# EAGLE design mimic4218 (EAGLE 7.5.0)
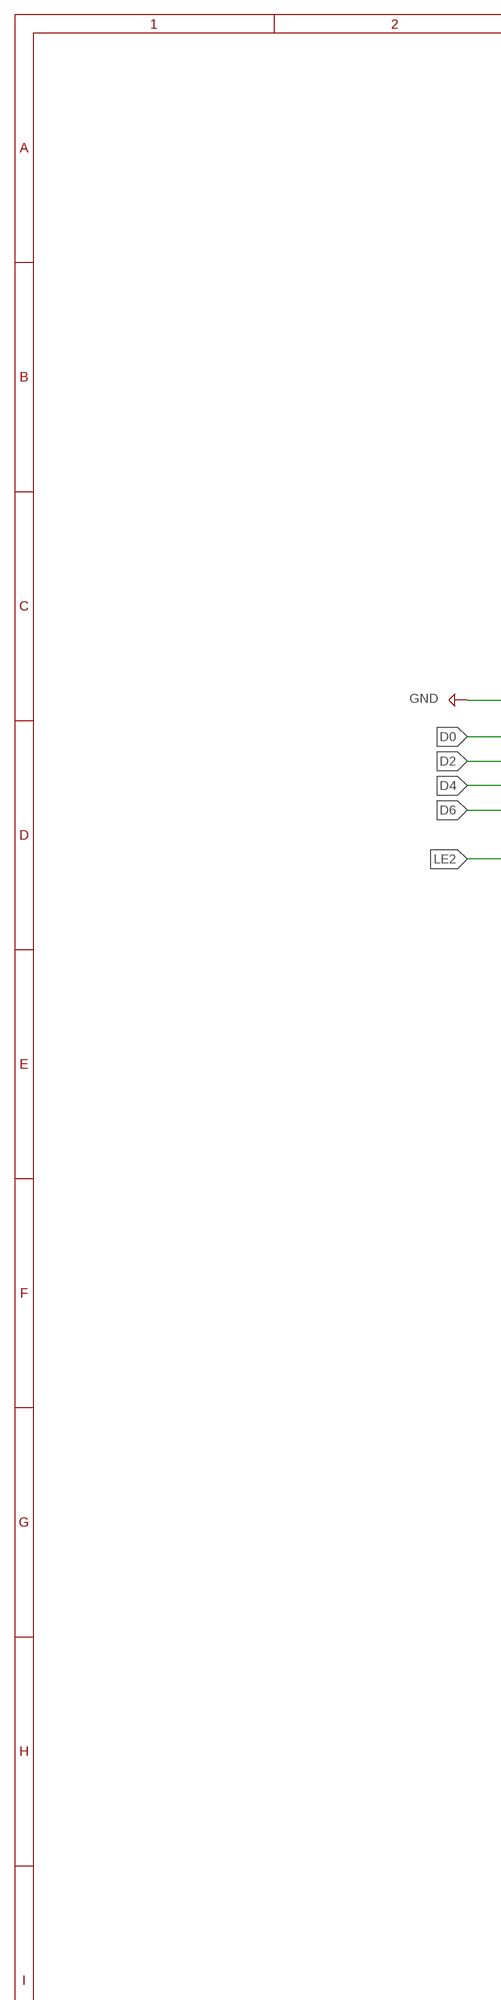
[diagram p0: schematic, sheet 1, part 1 of 2]
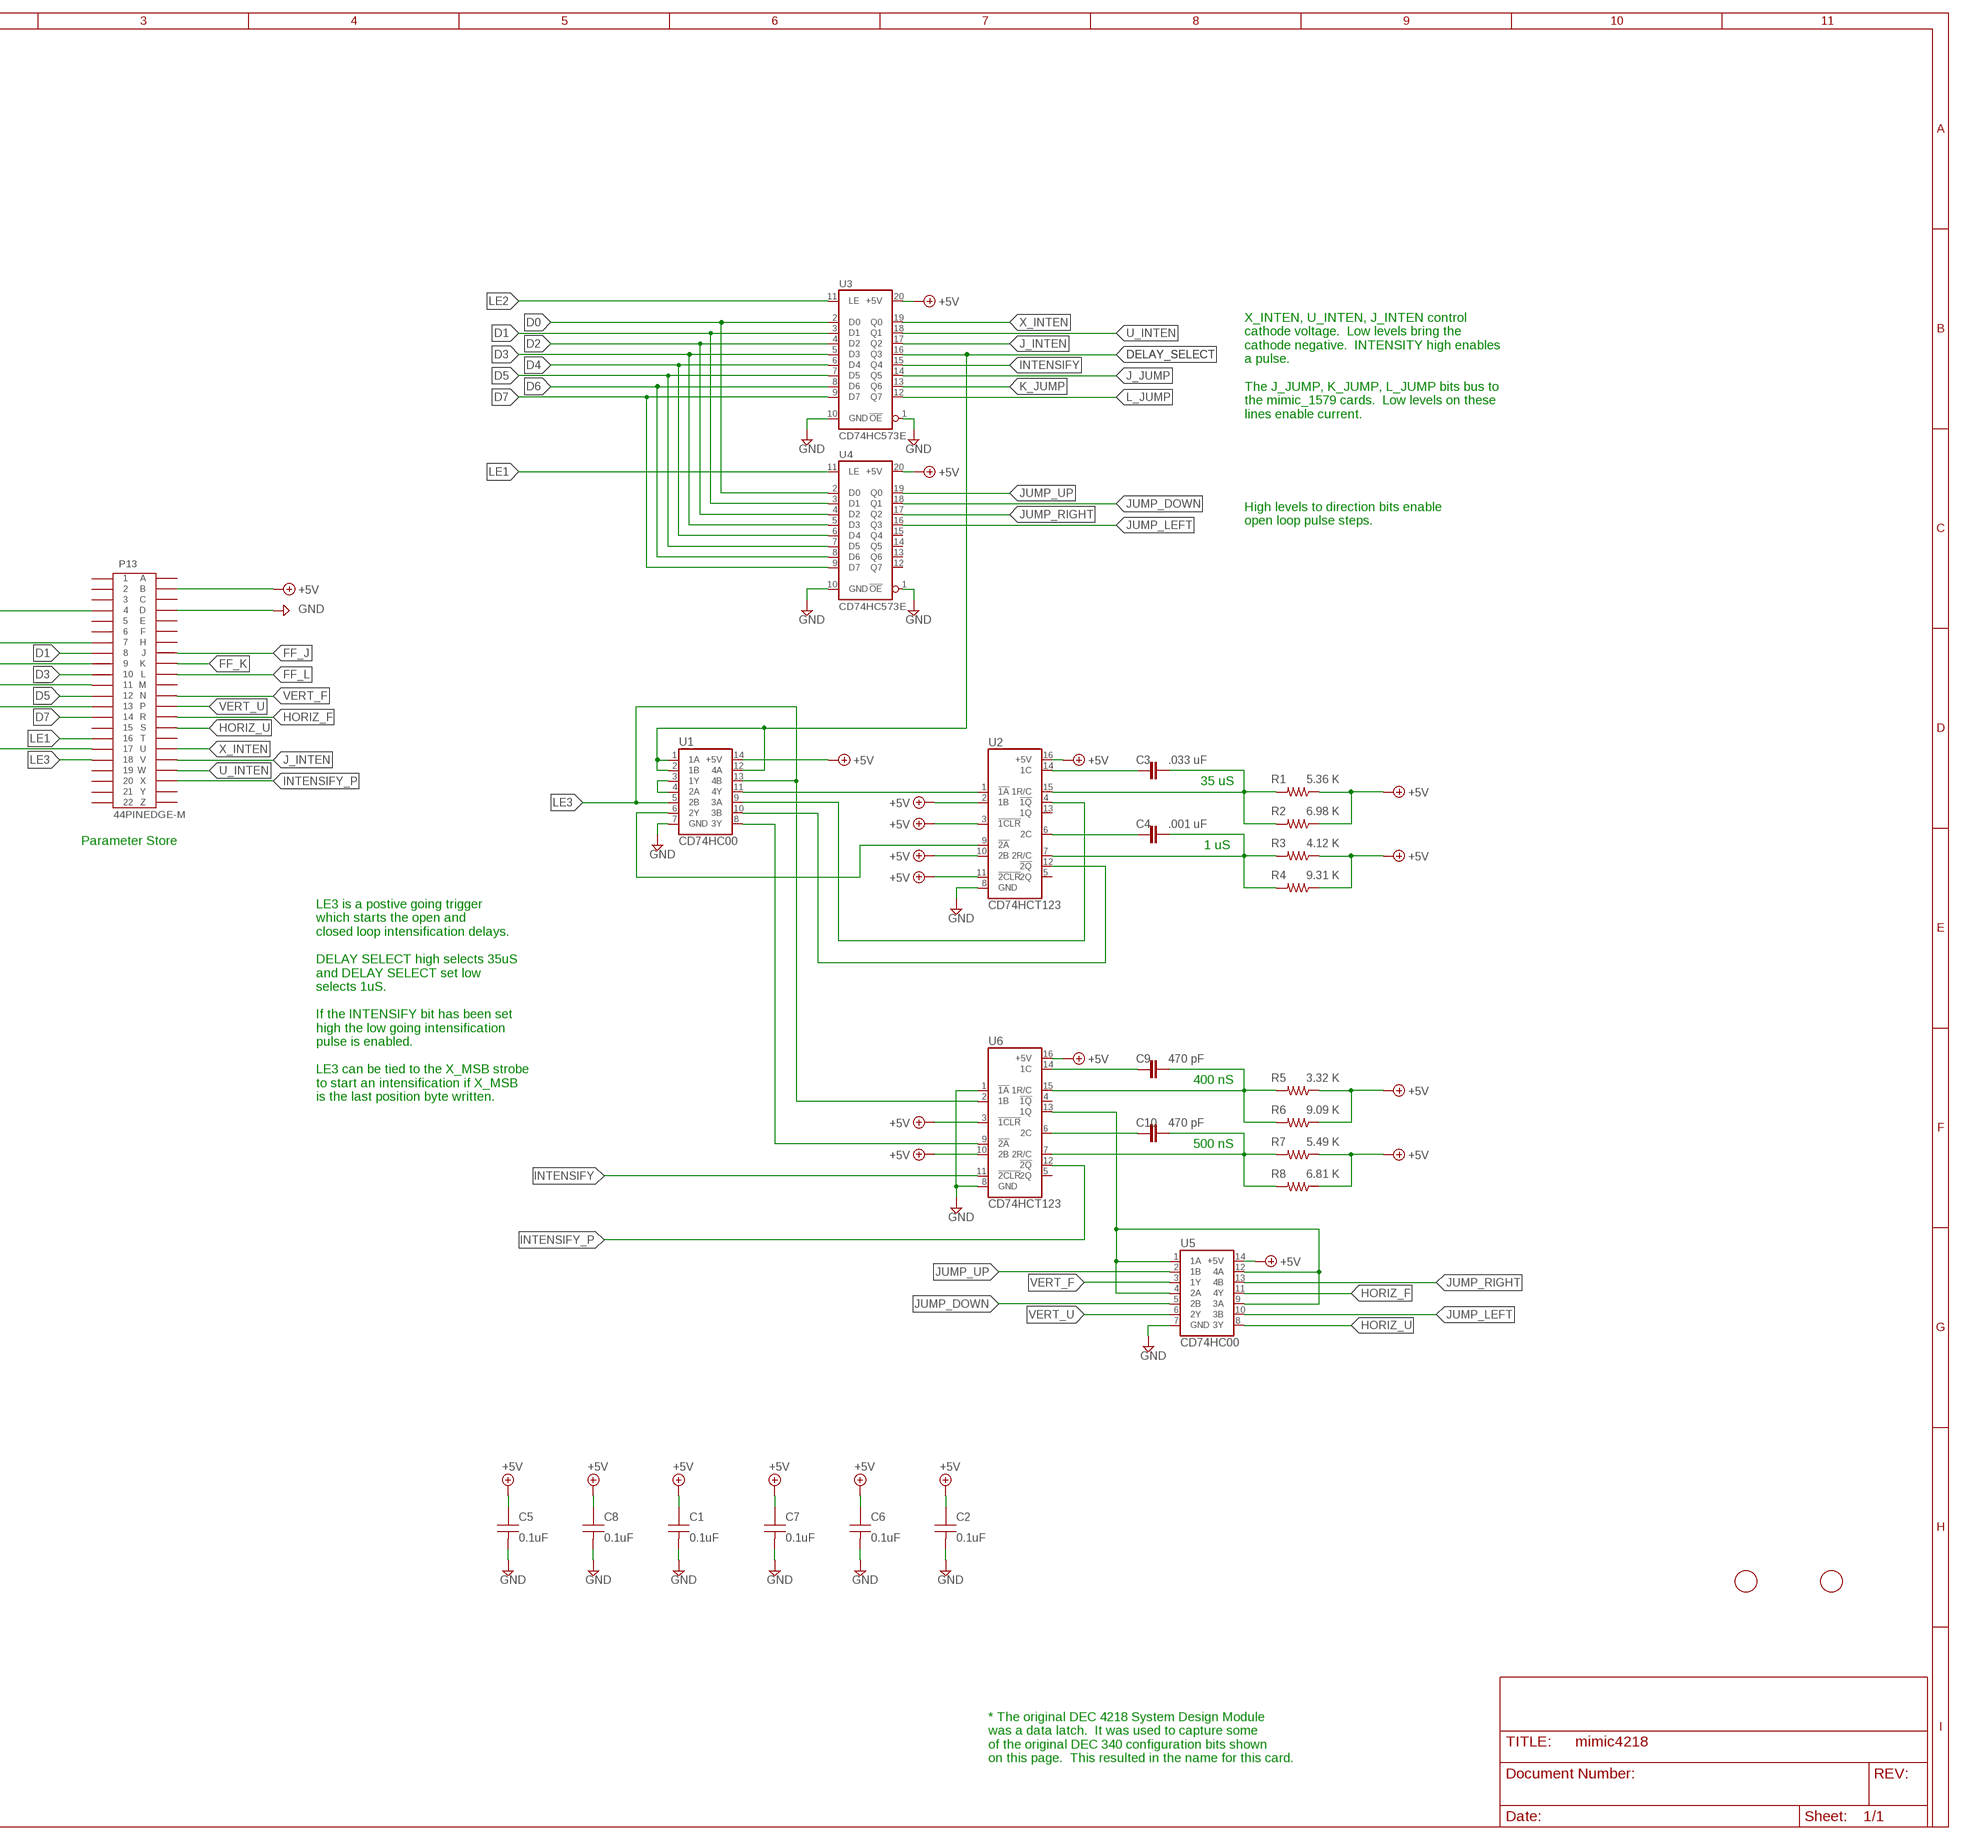
[diagram p1: schematic, sheet 1, part 2 of 2]

## Parts
C1  0.1uF  CAP0.1UF100V  [5MM_TH]
C2  0.1uF  CAP0.1UF100V  [5MM_TH]
C3  .033 uF  CAP_5MM  [5MM_TH]
C4  .001 uF  CAP_5MM  [5MM_TH]
C5  0.1uF  CAP0.1UF100V  [5MM_TH]
C6  0.1uF  CAP0.1UF100V  [5MM_TH]
C7  0.1uF  CAP0.1UF100V  [5MM_TH]
C8  0.1uF  CAP0.1UF100V  [5MM_TH]
C9  470 pF  CAP_5MM  [5MM_TH]
C10  470 pF  CAP_5MM  [5MM_TH]
P13  44PINEDGE-M  [44PINEDGE]
R1  5.36 K  R-1/4WATT  [0207/10]
R2  6.98 K  R-1/4WATT  [0207/10]
R3  4.12 K  R-1/4WATT  [0207/10]
R4  9.31 K  R-1/4WATT  [0207/10]
R5  3.32 K  R-1/4WATT  [0207/10]
R6  9.09 K  R-1/4WATT  [0207/10]
R7  5.49 K  R-1/4WATT  [0207/10]
R8  6.81 K  R-1/4WATT  [0207/10]
U1  CD74HC00  [DIP-14]
U2  CD74HCT123  [DIP-16]
U3  CD74HC573E  [DIP-20]
U4  CD74HC573E  [DIP-20]
U5  CD74HC00  [DIP-14]
U6  CD74HCT123  [DIP-16]
U$1  FIDUCIAL  [FIDUCIAL_1MM]
U$2  FIDUCIAL  [FIDUCIAL_1MM]

## Nets
+5V: C1.1 C2.1 C5.1 C6.1 C7.1 C8.1 P13.B R1.1 R2.1 R3.1 R4.1 R5.1 R6.1 R7.1 R8.1 U1.14(+5V) U2.2(1B) U2.3(!1CLR) U2.10(2B) U2.11(!2CLR) U2.16(+5V) U3.20(+5V) U4.20(+5V) U5.14(+5V) U6.3(!1CLR) U6.10(2B) U6.16(+5V)
D0: P13.7 U3.2(D0) U4.2(D0)
D1: P13.8 U3.3(D1) U4.3(D1)
D2: P13.9 U3.4(D2) U4.4(D2)
D3: P13.10 U3.5(D3) U4.5(D3)
D4: P13.11 U3.6(D4) U4.6(D4)
D5: P13.12 U3.7(D5) U4.7(D5)
D6: P13.13 U3.8(D6) U4.8(D6)
D7: P13.14 U3.9(D7) U4.9(D7)
DELAY_SELECT: U1.1(1A) U1.2(1B) U1.12(4A) U3.16(Q3)
FF_J: P13.J
FF_K: P13.K
FF_L: P13.L
GND: C1.2 C2.2 C5.2 C6.2 C7.2 C8.2 P13.4 P13.D U1.7(GND) U2.8(GND) U3.1(!OE) U3.10(GND) U4.1(!OE) U4.10(GND) U5.7(GND) U6.1(!1A) U6.8(GND)
HORIZ_F: P13.R U5.11(4Y)
HORIZ_U: P13.S U5.8(3Y)
INTENSIFY: U3.15(Q4) U6.11(!2CLR)
INTENSIFY_P: P13.X U6.12(!2Q)
J_INTEN: P13.V U3.17(Q2)
J_JUMP: U3.14(Q5)
JUMP_DOWN: U4.18(Q1) U5.5(2B)
JUMP_LEFT: U4.16(Q3) U5.10(3B)
JUMP_RIGHT: U4.17(Q2) U5.13(4B)
JUMP_UP: U4.19(Q0) U5.2(1B)
K_JUMP: U3.13(Q6)
L_JUMP: U3.12(Q7)
LE1: P13.16 U4.11(LE)
LE2: P13.17 U3.11(LE)
LE3: P13.18 U1.5(2B) U1.13(4B) U6.2(1B)
N$1: C3.1 U2.14(1C)
N$2: C3.2 R1.2 R2.2 U2.15(1R/C)
N$3: C4.1 U2.6(2C)
N$4: C4.2 R3.2 R4.2 U2.7(2R/C)
N$5: C9.1 U6.14(1C)
N$6: C10.2 R7.2 R8.2 U6.7(2R/C)
N$7: C10.1 U6.6(2C)
N$8: C9.2 R5.2 R6.2 U6.15(1R/C)
N$9: U1.11(4Y) U2.1(!1A)
N$10: U1.3(1Y) U1.4(2A)
N$11: U5.1(1A) U5.4(2A) U5.9(3A) U5.12(4A) U6.13(1Q)
N$12: U1.6(2Y) U2.9(!2A)
N$13: U1.9(3A) U2.4(!1Q)
N$14: U1.10(3B) U2.12(!2Q)
N$15: U1.8(3Y) U6.9(!2A)
U_INTEN: P13.W U3.18(Q1)
VERT_F: P13.N U5.3(1Y)
VERT_U: P13.P U5.6(2Y)
X_INTEN: P13.U U3.19(Q0)
Unconnected: P13.1 P13.2 P13.3 P13.5 P13.6 P13.15 P13.19 P13.20 P13.21 P13.22 P13.A P13.C P13.E P13.F P13.H P13.M P13.T P13.Y P13.Z U2.5(2Q) U2.13(1Q) U4.12(Q7) U4.13(Q6) U4.14(Q5) U4.15(Q4) U6.4(!1Q) U6.5(2Q)

## Notes on the sheet
- X_INTEN, U_INTEN, J_INTEN control 
  cathode voltage.  Low levels bring the 
  cathode negative.  INTENSITY high enables 
  a pulse.
  
  The J_JUMP, K_JUMP, L_JUMP bits bus to 
  the mimic_1579 cards.  Low levels on these 
  lines enable current.
- High levels to direction bits enable 
  open loop pulse steps.
- 35 uS
- Parameter Store
- 1 uS
- 400 nS
- LE3 is a postive going trigger 
  which starts the open and 
  closed loop intensification delays.
  
  DELAY SELECT high selects 35uS 
  and DELAY SELECT set low 
  selects 1uS.
  
  If the INTENSIFY bit has been set 
  high the low going intensification
  pulse is enabled.
  
  LE3 can be tied to the X_MSB strobe 
  to start an intensification if X_MSB 
  is the last position byte written.
- 500 nS
- * The original DEC 4218 System Design Module 
  was a data latch.  It was used to capture some 
  of the original DEC 340 configuration bits shown 
  on this page.  This resulted in the name for this card.

## Library data of the parts
C1 C2 C5-C8 = keiths:CAP0.1UF100V: 0.1µF ±10% 100V Ceramic X8R TH; MPN: FA26X8R2A104KNU06
C3 C4 C9 C10 = keiths:CAP_5MM: Through hole radial, 5m pin spacing.
P13 = keiths:44PINEDGE-M: 44 PIN EDGE CONNECTOR FOR PCB
R1-R8 = keiths:R-1/4WATT: Quarter watt through hole resistor.
U1 U5 = keiths:CD74HC00: Quad 2-Input NAND Gate
U2 U6 = keiths:CD74HCT123: High-Speed CMOS Logic Dual Retriggerable Monostable Multivibrator
U3 U4 = keiths:CD74HC573E: Octal Transparent D-Type Latches With 3-State Outputs
U$1 U$2 = adafruit:FIDUCIAL: For use by pick and place machines to calibrate the vision/machine, 1mm By microbuilder.eu

## Board
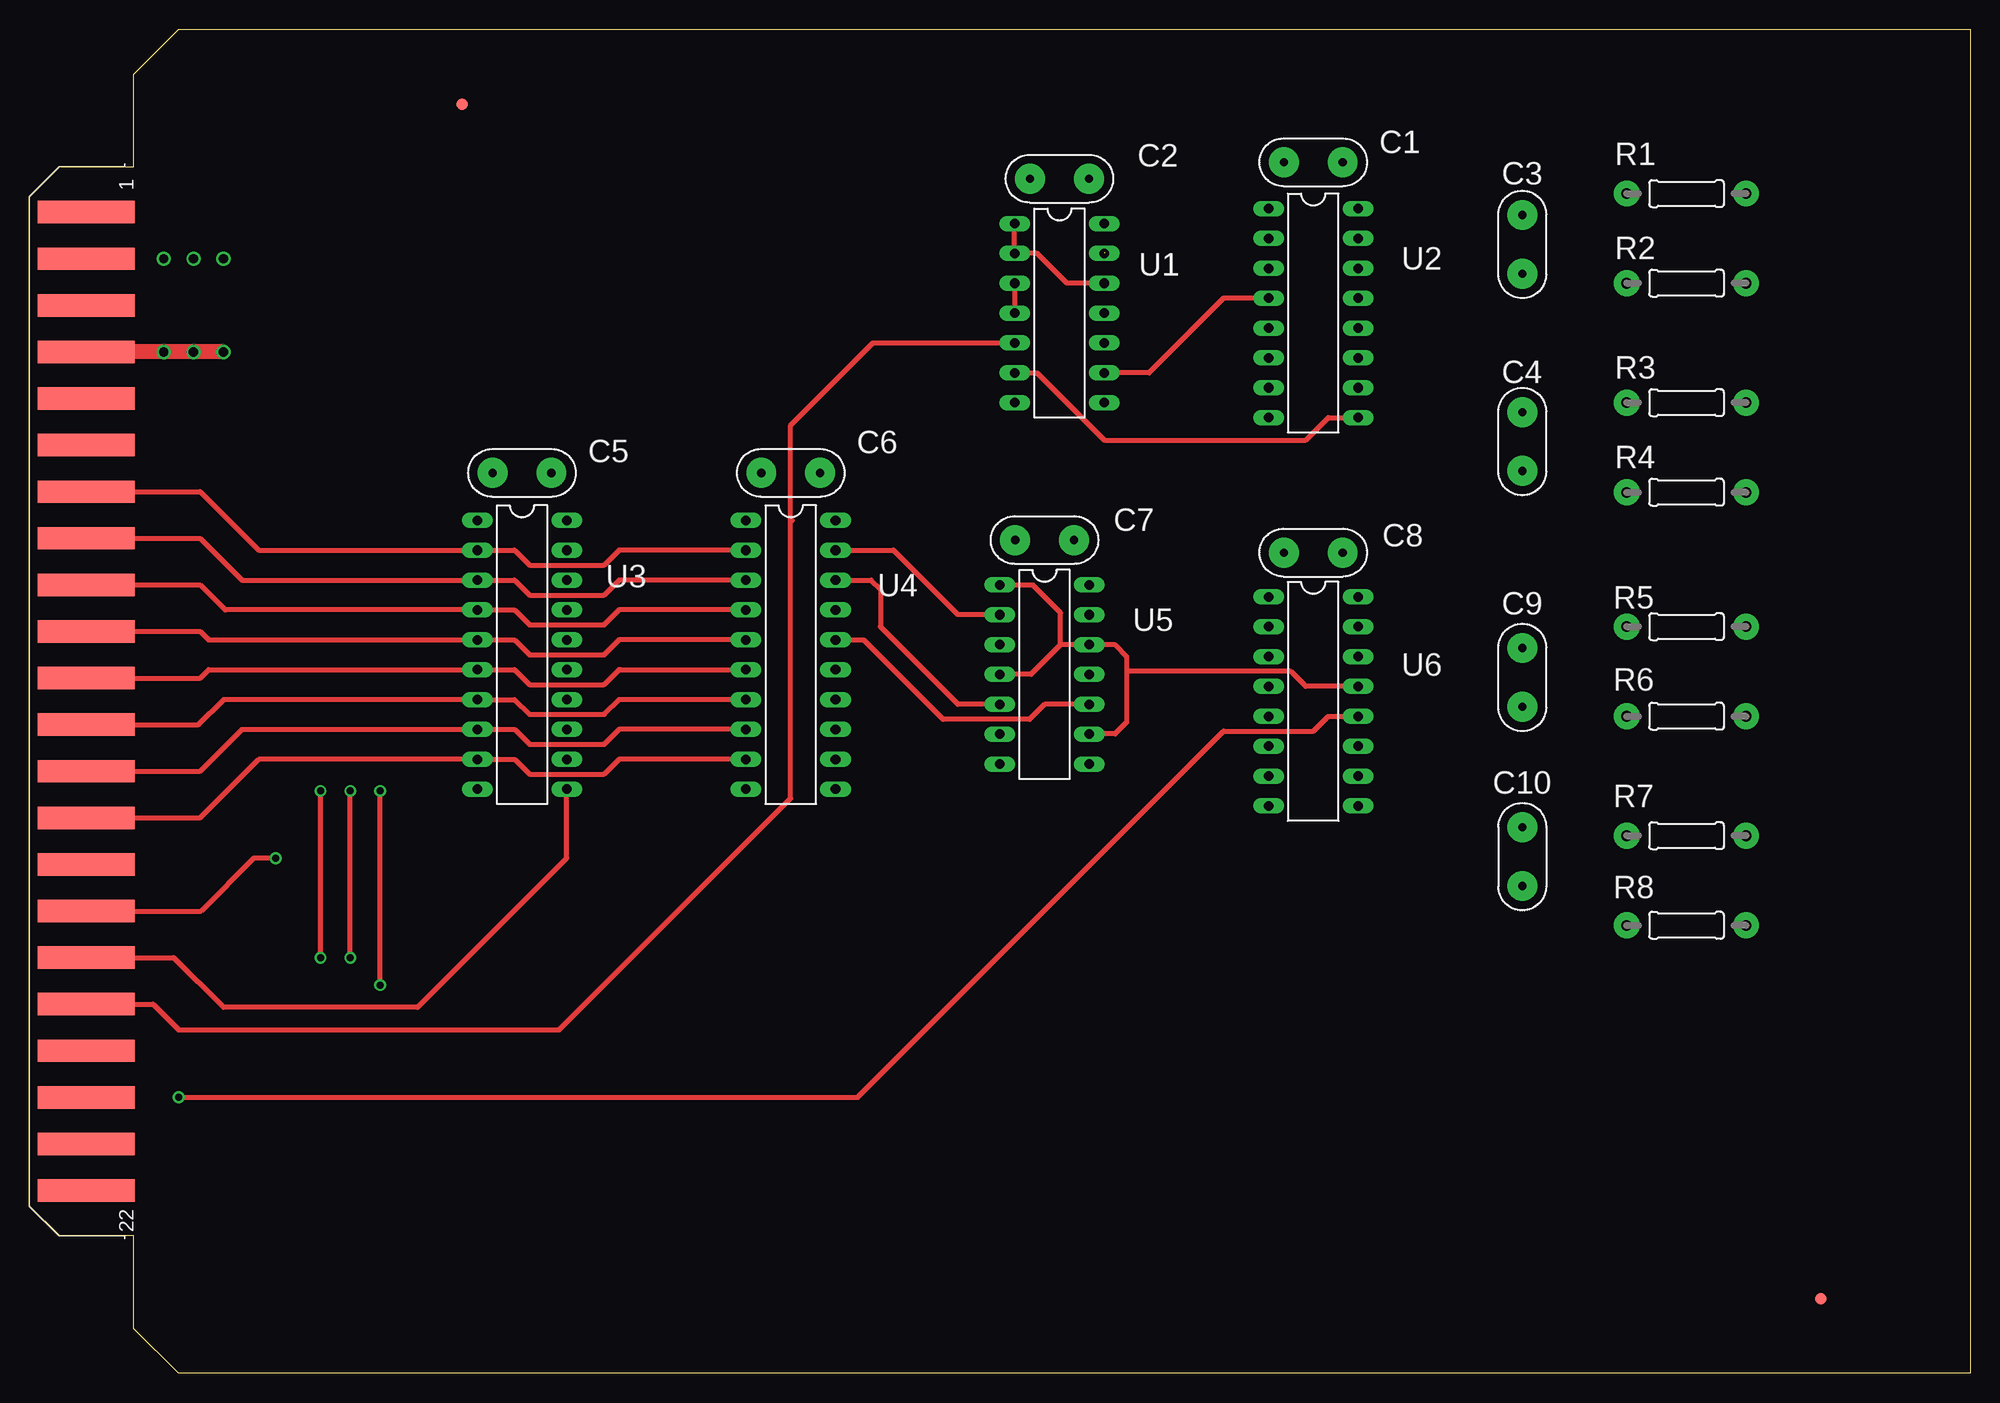
[diagram p2: board, top side]
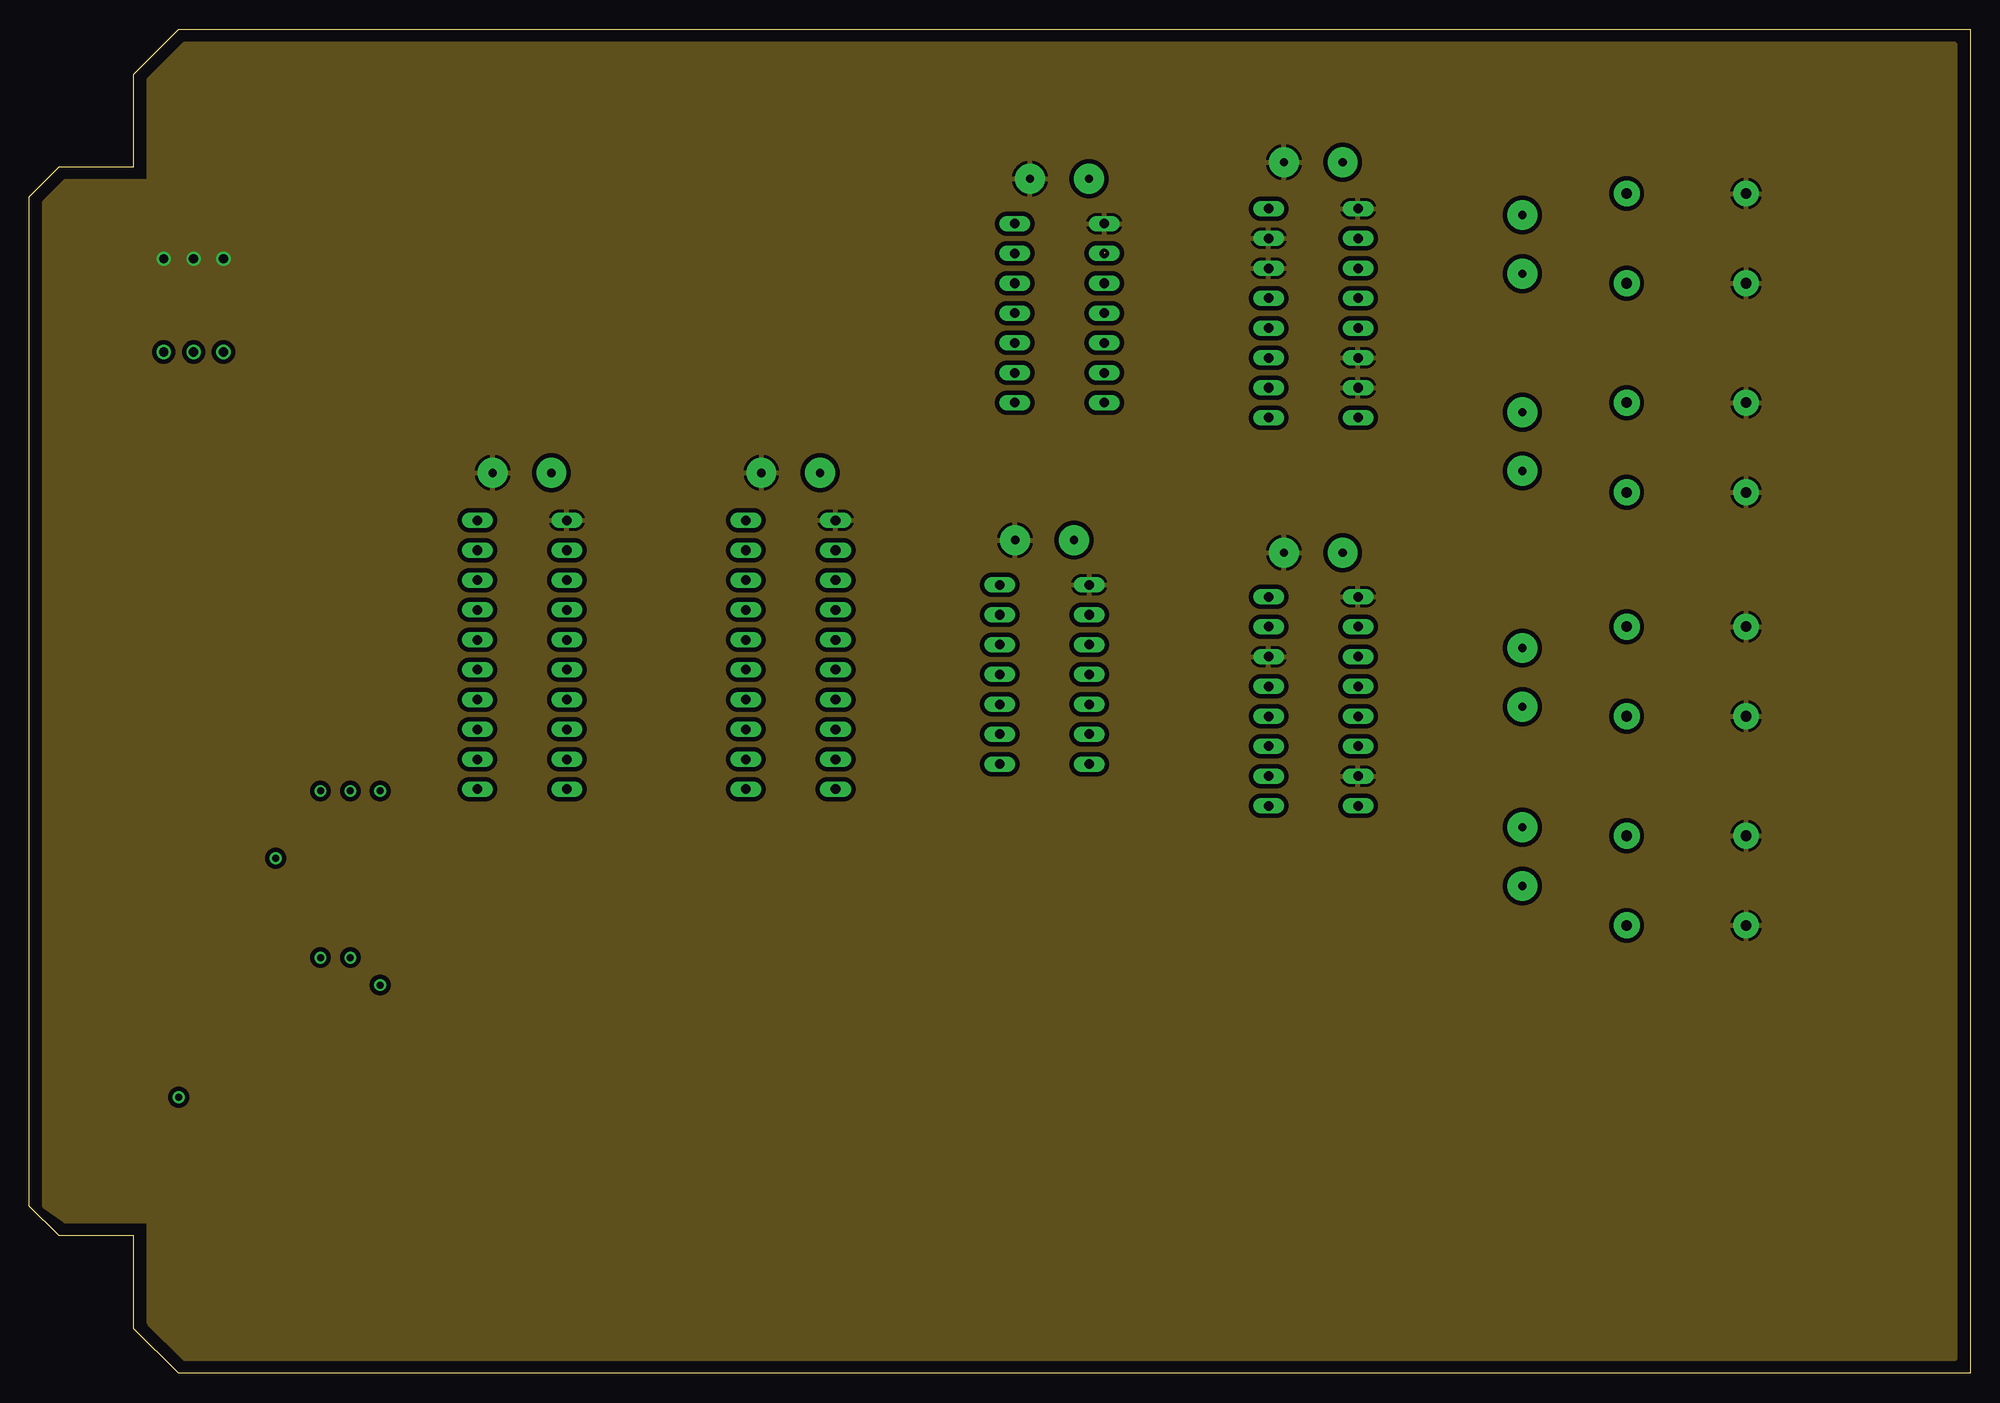
[diagram p3: board, inner layer VCC]
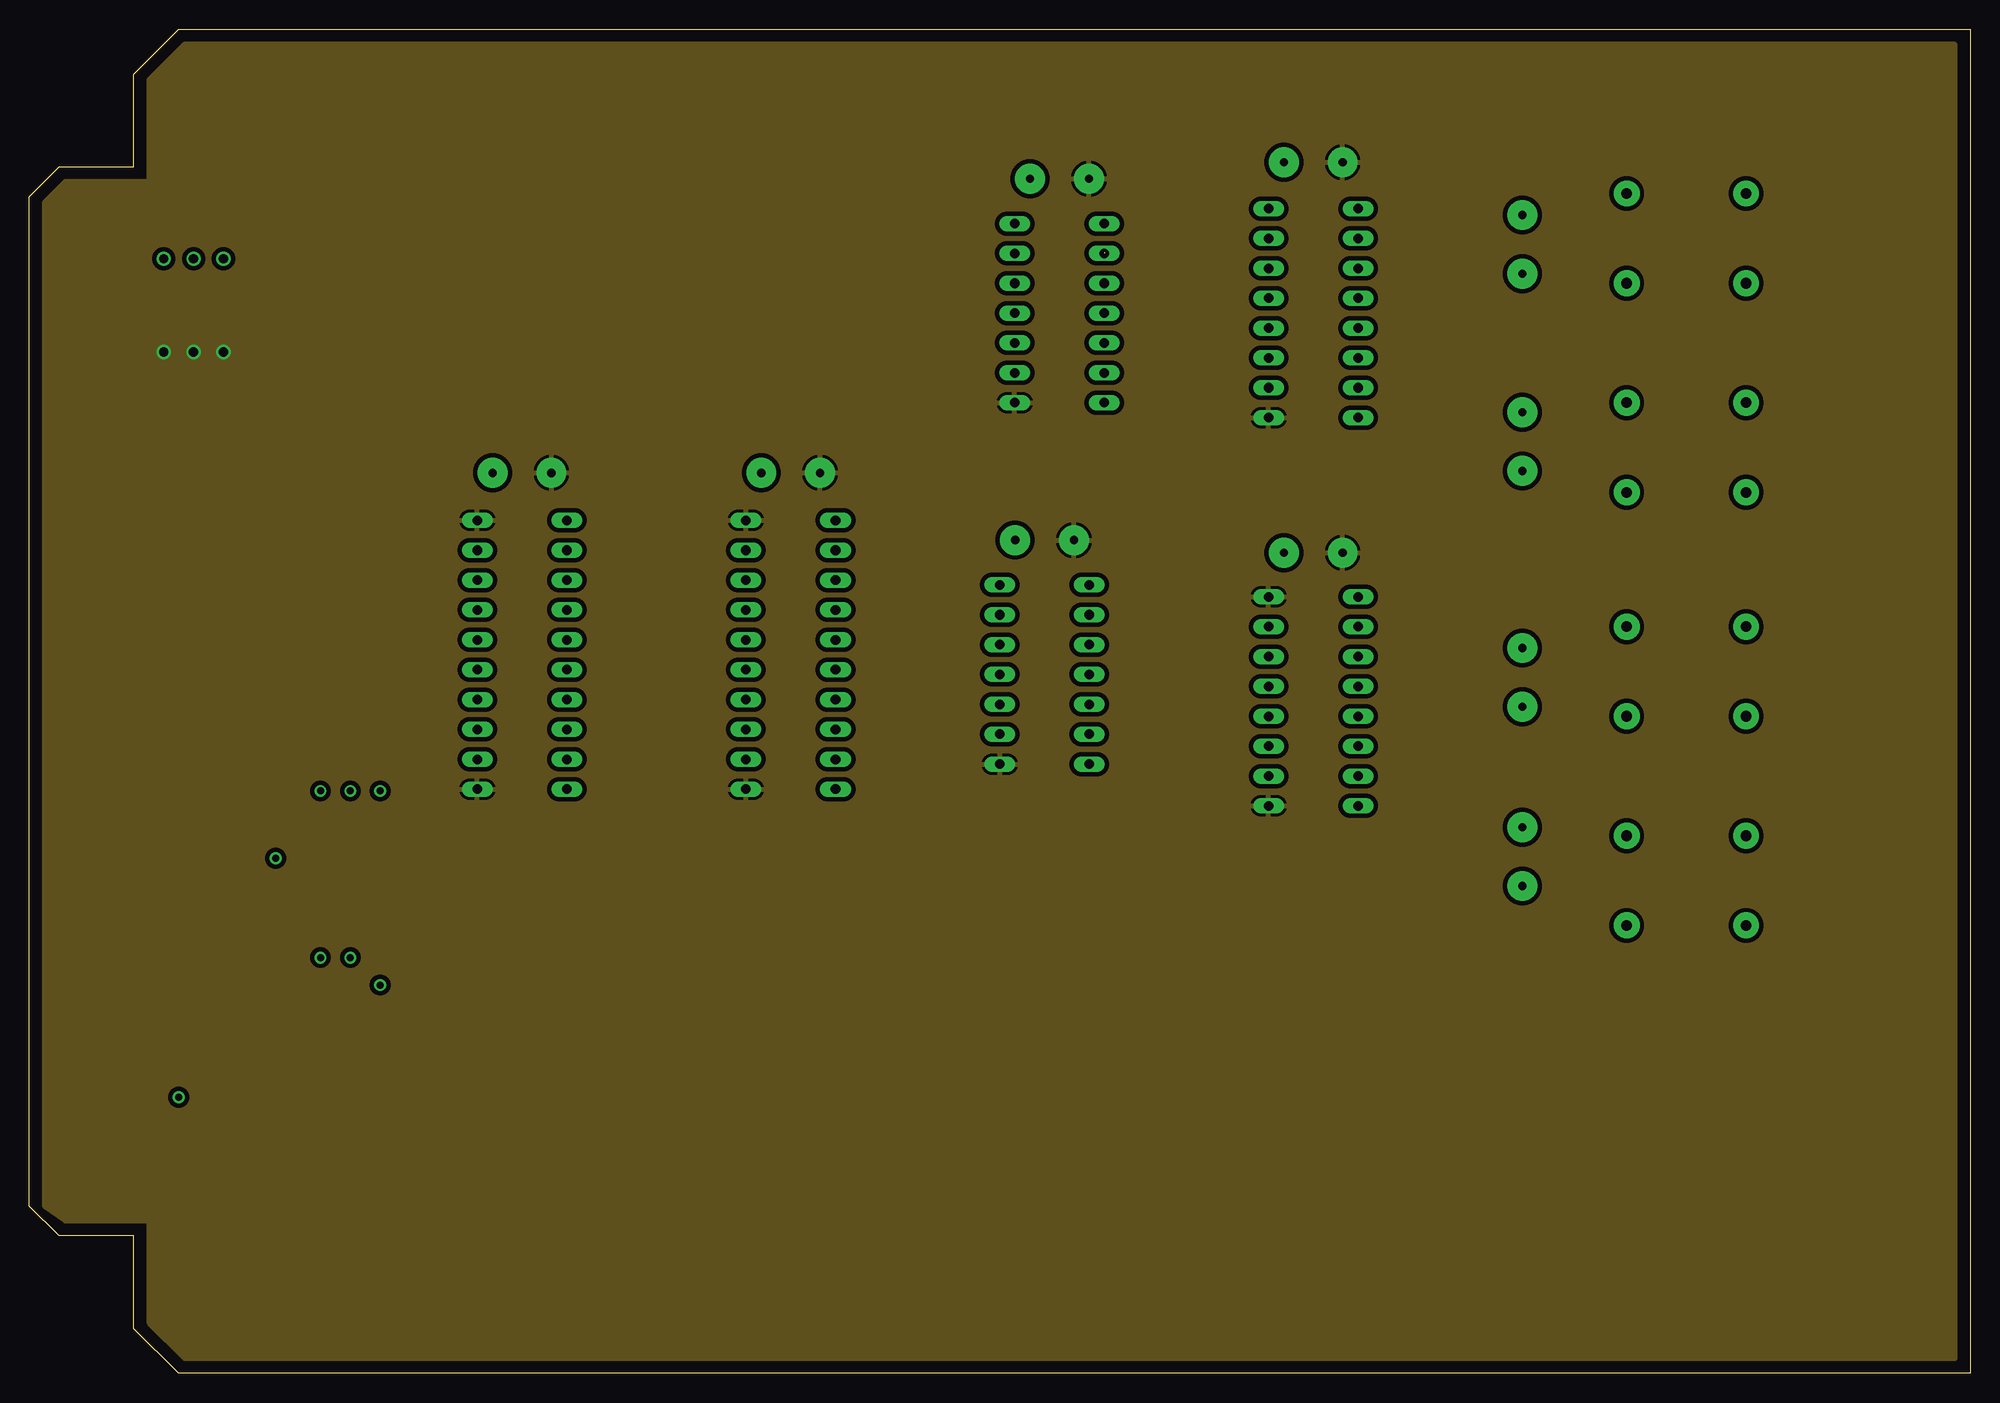
[diagram p4: board, inner layer GND]
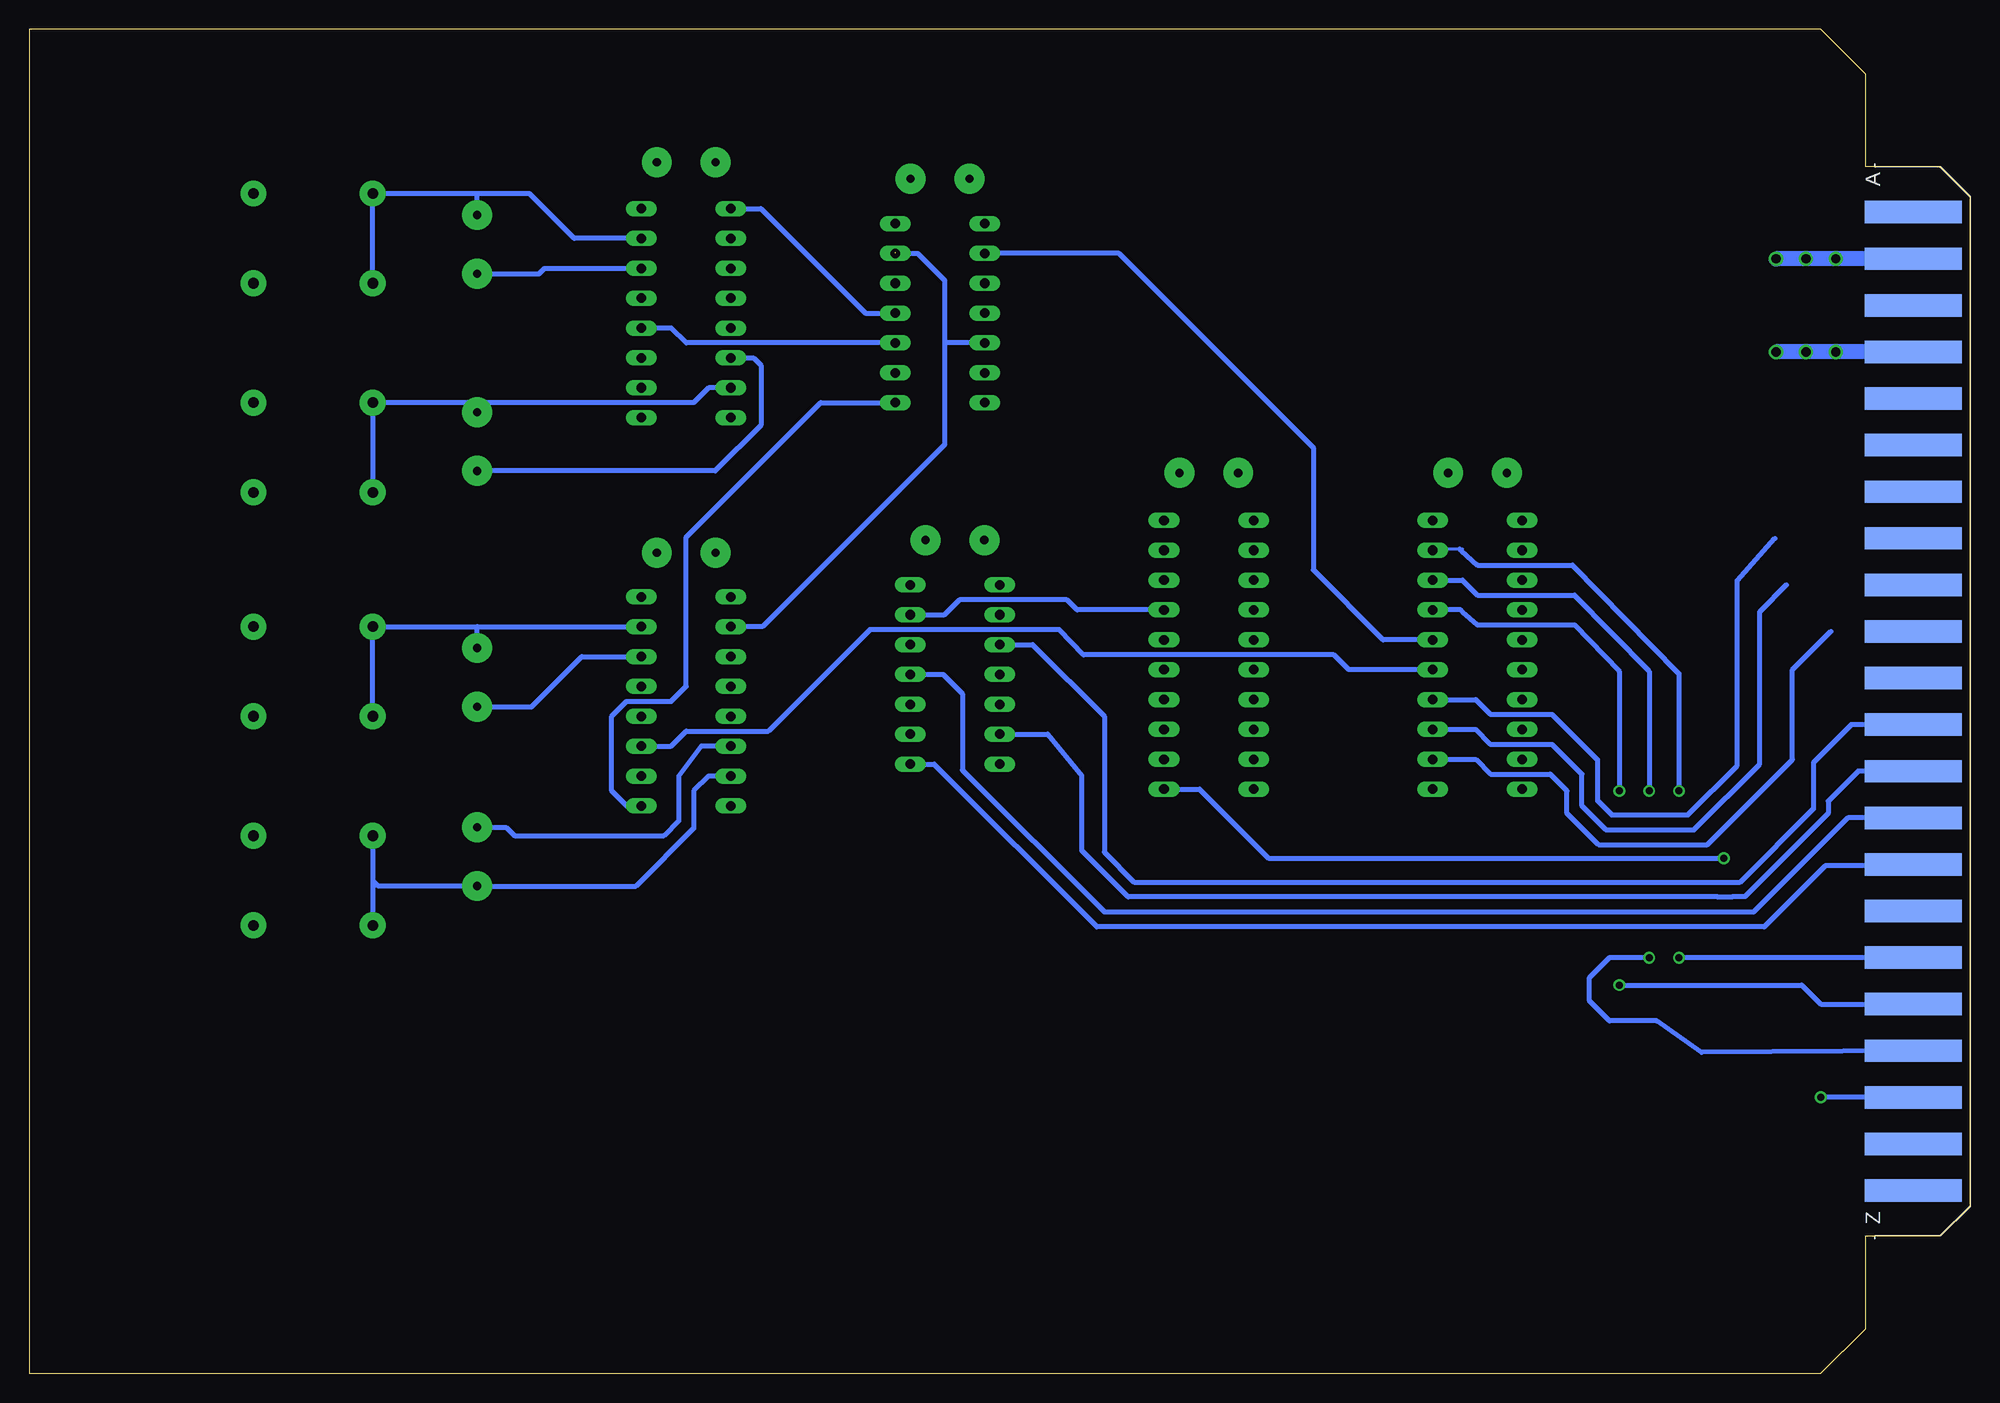
[diagram p5: board, bottom side, seen from below]

Size 165.1 x 114.3 mm. Coordinates in mm from the lower left corner, seen from the top.
Outline: 2.54,102.62 8.89,102.62 8.89,110.49 12.7,114.3 165.1,114.3 165.1,0 12.7,0 8.89,3.81 8.89,11.68 2.54,11.68 0,14.22 0,100.08 2.54,102.62
Copper layers (1+2*15+16): Top 0.035mm / dielectric 1.5mm / VCC 0.035mm / dielectric 0.15mm / GND 0.035mm / dielectric 0.2mm / Bottom 0.035mm
Design rules "four_layer_th *": minimum track width 10mil, minimum drill 23mil, track to track 15mil, track to pad 15mil, pad to pad 30mil, via to via 30mil, smd to smd 20mil, copper to edge 20mil, drill to drill 30mil, minimum pad ring 10mil, minimum via ring 8mil, stop-mask expansion 4mil, vias tented up to drill 0mil, thermal gap 10mil

### Footprints (pad centres in the part's own frame; a part is rotated, then mirrored left to right if it is on the bottom)
5MM_TH = drill 0.7 pad 2.54: 1 -2.5,0; 2 2.5,0
44PINEDGE = smd 1.905 x 8.255: 1 -41.605,4.826; 2 -37.643,4.826; 3 -33.68,4.826; 4 -29.718,4.826; 5 -25.756,4.826; 6 -21.793,4.826; 7 -17.831,4.826; 8 -13.868,4.826; 9 -9.906,4.826; 10 -5.944,4.826; 11 -1.981,4.826; 12 1.981,4.826; 13 5.944,4.826; 14 9.906,4.826; 15 13.868,4.826; 16 17.831,4.826; 17 21.793,4.826; 18 25.756,4.826; 19 29.718,4.826; 20 33.68,4.826; 21 37.643,4.826; 22 41.605,4.826 | smd 1.905 x 8.255 bottom: A -41.605,4.826; B -37.643,4.826; C -33.68,4.826; D -29.718,4.826; E -25.756,4.826; F -21.793,4.826; H -17.831,4.826; J -13.868,4.826; K -9.906,4.826; L -5.944,4.826; M -1.981,4.826; N 1.981,4.826; P 5.944,4.826; R 9.906,4.826; S 13.868,4.826; T 17.831,4.826; U 21.793,4.826; V 25.756,4.826; W 29.718,4.826; X 33.68,4.826; Y 37.643,4.826; Z 41.605,4.826
0207/10 = drill 0.9 pad 2.184: 1 -5.08,0; 2 5.08,0
DIP-14 = drill 0.813 long: 1 -7.62,-3.81; 2 -5.08,-3.81; 3 -2.54,-3.81; 4 0,-3.81; 5 2.54,-3.81; 6 5.08,-3.81; 7 7.62,-3.81; 8 7.62,3.81; 9 5.08,3.81; 10 2.54,3.81; 11 0,3.81; 12 -2.54,3.81; 13 -5.08,3.81; 14 -7.62,3.81
DIP-16 = drill 0.813 long: 1 -8.89,-3.81; 2 -6.35,-3.81; 3 -3.81,-3.81; 4 -1.27,-3.81; 5 1.27,-3.81; 6 3.81,-3.81; 7 6.35,-3.81; 8 8.89,-3.81; 9 8.89,3.81; 10 6.35,3.81; 11 3.81,3.81; 12 1.27,3.81; 13 -1.27,3.81; 14 -3.81,3.81; 15 -6.35,3.81; 16 -8.89,3.81
DIP-20 = drill 0.813 long: 1 -11.43,-3.81; 2 -8.89,-3.81; 3 -6.35,-3.81; 4 -3.81,-3.81; 5 -1.27,-3.81; 6 1.27,-3.81; 7 3.81,-3.81; 8 6.35,-3.81; 9 8.89,-3.81; 10 11.43,-3.81; 11 11.43,3.81; 12 8.89,3.81; 13 6.35,3.81; 14 3.81,3.81; 15 1.27,3.81; 16 -1.27,3.81; 17 -3.81,3.81; 18 -6.35,3.81; 19 -8.89,3.81; 20 -11.43,3.81
FIDUCIAL_1MM = smd 1 x 1: 1 0,0

### Placement (x,y rotation side)
C1  109.22,103 0 top
C2  87.63,101.6 0 top
C3  127,96.01 90 top
C4  127,79.25 90 top
C5  41.91,76.58 0 top
C6  64.77,76.58 0 top
C7  86.36,70.87 0 top
C8  109.22,69.8 0 top
C9  127,59.18 90 top
C10  127,43.94 270 top
P13  0,57.15 270 top
R1  140.97,100.33 180 top
R2  140.97,92.71 180 top
R3  140.97,82.55 180 top
R4  140.97,74.93 180 top
R5  140.97,63.5 180 top
R6  140.97,55.88 180 top
R7  140.97,45.72 180 top
R8  140.97,38.1 180 top
U1  87.63,90.17 270 top
U2  109.22,90.17 270 top
U3  41.91,61.11 270 top
U4  64.77,61.11 270 top
U5  86.36,59.44 270 top
U6  109.22,57.15 270 top
U$1  152.4,6.35 0 top
U$2  36.83,107.95 0 top

### Tracks (layer width: path | path; a pad name or v marks a point on that pad's centre or on a via)
+5V  (via drill 0.8)
  Bottom 1.27: P13.B v16.51,94.79
  other vias: 13.97,94.79 11.43,94.79
  pour VCC: 10.16,101.35 3.05,101.35 1.27,99.57 1.27,14.22 3.05,12.95 10.16,12.95 10.16,4.32 13.21,1.27 163.83,1.27 163.83,113.03 13.21,113.03 10.16,109.98
D0
  Top 0.406: P13.7 14.53,74.98 19.51,70 U3.2 41.27,70 42.55,68.73 48.9,68.73 50.16,70 U4.2
D1
  Top 0.406: P13.8 14.53,71.02 18.09,67.46 U3.3 41.27,67.46 42.55,66.19 48.9,66.19 50.16,67.46 U4.3
D2
  Top 0.406: P13.9 14.53,67.06 16.66,64.92 | 16.66,64.92 U3.4 41.27,64.92 42.55,63.65 48.9,63.65 50.16,64.92 U4.4 | 16.66,64.92 16.64,64.92
D3
  Top 0.406: P13.10 14.53,63.09 15.24,62.38 U3.5 41.27,62.38 42.55,61.11 48.9,61.11 50.16,62.38 U4.5
D4
  Top 0.254: 50.29,59.85 50.16,59.84
  Top 0.406: P13.11 14.53,59.13 15.24,59.84 U3.6 41.27,59.84 42.55,58.57 48.9,58.57 50.16,59.84 | 50.29,59.85 U4.6
D5
  Top 0.254: 5.08,55.37 P13.12
  Top 0.406: U4.7 50.16,57.3 48.9,56.03 42.55,56.03 41.27,57.3 U3.7 16.51,57.3 14.38,55.17 6.35,55.17 | 5.08,55.17 6.35,55.17 | 5.08,55.37 6.15,55.37 6.35,55.17
D6
  Top 0.406: P13.13 14.53,51.21 18.09,54.76 U3.8 41.27,54.76 42.55,53.49 48.9,53.49 50.16,54.76 U4.8
D7
  Top 0.406: P13.14 14.53,47.24 19.51,52.22 U3.9 41.27,52.22 42.55,50.95 48.9,50.95 50.16,52.22 U4.9
DELAY_SELECT
  Top 0.406: U1.12 88.27,92.71 85.72,95.25 U1.2 U1.1
  Bottom 0.406: U3.16 49.94,62.38 55.88,68.33 55.88,78.74 72.39,95.25 U1.2
GND  (via drill 0.8)
  Top 1.27: v16.51,86.87 v13.97,86.87 v11.43,86.87 P13.4
  Bottom 1.27: P13.4 v16.51,86.87
  pour GND: 10.16,109.98 10.16,101.35 3.05,101.35 1.27,99.57 1.27,14.22 3.05,12.95 10.16,12.95 10.16,4.32 13.21,1.27 163.83,1.27 163.83,113.03 13.21,113.03
HORIZ_F
  Bottom 0.406: P13.R 10.41,47.24 18.41,39.24 73.66,39.24 85.72,51.31 85.72,57.78 87.38,59.44 U5.11
HORIZ_U
  Bottom 0.406: P13.S 5.08,43.18 12.32,43.18 17.53,37.97 74.3,37.97 88.14,51.82 U5.8
INTENSIFY
  Bottom 0.406: U3.15 52.86,59.84 54.13,61.11 75.41,61.11 77.47,63.25 93.6,63.25 102.23,54.61 109.22,54.61 110.49,53.34 U6.11
INTENSIFY_P  (via drill 0.6)
  Top 0.406: v12.7,23.47 70.46,23.47 101.6,54.61 109.22,54.61 110.49,55.88 U6.12
  Bottom 0.406: P13.X v12.7,23.47
J_INTEN  (via drill 0.6)
  Top 0.406: v29.84,33.02 v29.84,49.53
  Bottom 0.254: 5.08,31.39 P13.V
  Bottom 0.406: v29.84,49.53 29.84,59.69 33.66,63.65 41.91,63.65 43.18,64.77 43.33,64.92 U3.17 | 5.08,31.39 12.7,31.39 14.33,33.02 v29.84,33.02
J_JUMP
  Bottom 0.406: U3.14 42.06,57.3 40.79,56.03 35.56,56.03 31.67,52.15 31.67,48.69 30.48,47.5 24,47.5 19.81,51.69 19.81,67.42 16.61,71.02
JUMP_DOWN
  Top 0.406: U5.5 78.99,56.9 72.39,63.5 72.39,66.67 71.6,67.46 U4.18
JUMP_LEFT
  Top 0.406: U5.10 86.36,56.9 85.09,55.63 77.72,55.63 70.97,62.38 U4.16
JUMP_RIGHT
  Bottom 0.406: U4.17 75.97,64.92 76.83,65.79 85.98,65.79 87.25,64.52 U5.13
JUMP_UP
  Top 0.406: U5.2 78.99,64.52 73.51,70 U4.19
K_JUMP
  Bottom 0.406: U3.13 42.06,54.76 40.79,53.49 35.56,53.49 33.02,50.95 33.02,48.26 30.99,46.23 23.5,46.23 17.91,51.82 17.91,64.77 15.62,67.06
L_JUMP
  Bottom 0.406: U3.12 42.06,52.22 40.79,50.95 35.71,50.95 34.29,49.53 34.29,47.62 31.62,44.96 22.35,44.96 15.11,52.2 15.11,59.82 11.84,63.09
LE1  (via drill 0.6)
  Top 0.406: P13.16 14.61,39.32 19.1,43.81 v20.95,43.81
  Bottom 0.406: U4.11 65.56,49.68 59.69,43.81 v20.95,43.81
LE2
  Top 0.406: U3.11 45.72,43.81 33.02,31.11 16.51,31.11 12.27,35.36 P13.17
LE3  (1 unrouted)
  Top 0.406: P13.18 10.52,31.39 12.7,29.21 45.09,29.21 64.77,48.9 64.77,72.52 | 64.9,72.52 64.77,72.52 | 64.77,72.52 64.77,80.64 71.75,87.63 U1.5
  Bottom 0.406: 91.44,95.33 91.36,95.25 89.53,95.25 87.25,92.96 87.25,87.63 | 87.25,87.63 87.25,78.99 102.74,63.5 U6.2 | U1.5 87.25,87.63
N$1
  Bottom 0.406: C3.1 121.75,93.51 121.28,93.98 U2.14
N$2
  Bottom 0.406: U2.15 118.75,96.52 122.56,100.33 127,100.33 | 127,100.33 R1.2 R2.2 | C3.2 127,100.33
N$3
  Bottom 0.406: U2.6 103.5,86.36 102.87,85.72 102.87,80.64 106.77,76.75 C4.1
N$4
  Bottom 0.406: U2.7 107.31,83.82 108.58,82.55 127,82.55 | 127,82.55 R3.2 R4.2 | C4.2 127,82.55
N$5
  Bottom 0.406: C9.1 122.39,56.68 118.11,60.96 U6.14
N$6
  Bottom 0.406: U6.7 107.31,50.8 108.58,49.53 108.58,46.35 113.5,41.44 C10.2 135.42,41.44 135.89,41.91 | R7.2 135.89,41.91 | 135.89,41.91 R8.2
N$7
  Bottom 0.406: U6.6 107.95,53.34 109.86,50.8 109.86,46.99 111.12,45.72 123.83,45.72 124.55,46.44 C10.1
N$8
  Bottom 0.406: 127,63.5 R5.2 R6.2 | 127,63.5 U6.15 | C9.2 127,63.5
N$9
  Bottom 0.406: U2.1 102.87,99.06 93.98,90.17 U1.11
N$10
  Top 0.406: U1.3 U1.4
N$11
  Top 0.406: 87.73,61.95 85.22,59.44 U5.4 | 87.73,61.95 87.73,64.67 85.34,67.06 U5.1 | 93.34,59.69 93.34,60.96 92.35,61.95 90.19,61.95 U5.12 87.76,61.98 87.73,61.95 | 93.34,59.69 93.34,55.37 92.35,54.38 90.17,54.38 U5.9 | 93.34,59.69 107.31,59.69 108.58,58.42 U6.13
N$12
  Top 0.406: U1.6 85.72,85.09 91.44,79.38 108.58,79.38 110.49,81.28 U2.9
N$13
  Top 0.406: U2.4 101.6,91.44 95.25,85.09 U1.9
N$14
  Bottom 0.406: U1.10 109.22,87.63 110.49,88.9 U2.12
N$15
  Bottom 0.406: U6.9 114.3,48.26 115.57,49.53 115.57,55.88 114.3,57.15 110.49,57.15 109.22,58.42 109.22,71.12 97.79,82.55 U1.8
U_INTEN  (via drill 0.6)
  Top 0.406: v27.3,35.36 v27.3,49.53
  Bottom 0.406: U3.18 43.18,67.46 41.91,66.19 33.66,66.19 27.3,59.69 v27.3,49.53 | P13.W 22.86,27.3 26.67,29.97 30.68,29.97 32.38,31.67 32.38,33.66 30.68,35.36 v27.3,35.36
VERT_F
  Bottom 0.406: U5.3 79.76,61.98 73.66,55.88 73.66,44.32 71.12,41.78 19.56,41.78 13.34,48.01 13.34,51.94 10.11,55.17 P13.N
VERT_U
  Bottom 0.406: P13.P 9.53,51.21 12.06,48.67 12.06,47.62 19.15,40.54 20.19,40.54 21.46,40.51 71.63,40.51 75.56,44.45 75.56,50.8 78.49,54.36 U5.6
X_INTEN  (via drill 0.6)
  Top 0.406: v24.77,35.36 v24.77,49.53
  Bottom 0.254: 5.08,35.36 P13.U | U3.19 45.72,70.1 43.18,70.1 43.29,69.98
  Bottom 0.406: 43.43,70.1 43.29,69.98 41.91,68.73 33.83,68.73 24.77,59.51 v24.77,49.53 | 5.08,35.36 v24.77,35.36

### Text on the board
logo: board type 4218 / parameter store